# Altium schematic sheet CAn tranceiver.SchDoc
size 431 x 279 mm; SheetNumber: 6; SheetTotal: 6
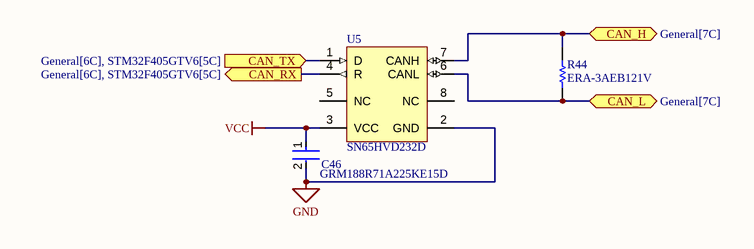
[diagram p0: CAn tranceiver.SchDoc]

## Parts
C46  GRM188R71A225KE15D  [FP-GRM188-0_1-e0_2_0_5-MFG]
R44  ERA-3AEB121V  [RESC1608X55X30NL20T20]
U5  SN65HVD232D  [D0008A_L]

## Ports
CAN_H (bidir, see General[7C]), CAN_L (bidir, see General[7C]), CAN_RX (out, see General[6C], STM32F405GTV6[5C]), CAN_TX (in, see General[6C], STM32F405GTV6[5C])

## Nets
GND: C46.2 U5.2(GND)
VCC: C46.1 U5.3(VCC)
CAN_H: R44.1 U5.7(CANH) ; port CAN_H
CAN_L: R44.2 U5.6(CANL) ; port CAN_L
CAN_RX: U5.4(R) ; port CAN_RX
CAN_TX: U5.1(D) ; port CAN_TX

Not connected (* = marked no-connect by the designer): U5 5(NC) 8(NC)

## Notes on the sheet
- DWG. NO.
- REV.
- SHT.
- THIS DOCUMENT AND THE DATA DISCLOSED HEREIN OR HEREWITH IS THE PROPERTY OF ALTIUM LIMITED AND MAY BE FREELY DISTRIBUTED IN WHOLE. NO RIGHTS ARE RESERVED OR EXPRESS OR IMPLIED WARANTEE GIVEN.
- REVISION
- DESCRIPTION
- DATE
- APPROVED
- ENG:
- APPROVALS
- PROJECT
- DSN:
- CHK:
- REFERENCE DOCUMENTS
- PROJECT REVISION:
- TITLE
- DOCUMENT REVISION:
- DESIGN ITEM:
- BOM:
- FAB DWG:
- PCB DWG:
- ASSY DWG:
- SCALE:
- SIZE
- B
- CAGE CODE
- FILE NAME
- DWG NO.
- SHEET
- OF
- REV

## Library data of the parts
C46 = CMP-2006-02836-2: Chip Multilayer Ceramic Capacitors for General Purpose, 0603, 2.2uF, X7R, 15%, 10%, 10V; Case Code (Metric): 1608; Height: 0.8mm; Packaging: Cut Tape; Voltage: 10V; Lead Free: Lead Free; Min Operating Temperature: -55°C; Voltage Rating (DC): 10V; Max Operating Temperature: 125°C; Voltage Rating: 10V; Dielectric: X7R; Depth: 0.8mm; Case Code (Imperial): 0603; Termination: SMD/SMT; Case/Package: 0603; Number of Pins: 2; REACH SVHC: No SVHC; Mount: Surface Mount; Width: 0.031inch; Material: Ceramic; Capacitance: 2.2uF; Package Quantity: 1; Weight: 7.1E-05oz; Length: 1.6mm; Thickness: 0.035inch; Tolerance: 10%
R44 = CMP-2000-00896-1: Manufacturer: Panasonic; Part Number: ERA-3AEB121V
U5 = CMP-0315-00073-2: 3.3 V CAN Transceiver, 17 mA, -40 to 85 degC, 8-pin SOIC (D), Green (RoHS & no Sb/Br); Manufacturer: Texas Instruments; Supply Voltage(s)(V): 3.3; Transient Pulse Protection(V): -25 to 25; ICC(Max)(mA): 17; Drivers Per Package: 1; Rating: Catalog; Code_JEDEC: MS-012AA; Mounting Technology: Surface Mount; PackageDescription: 8-Pin Plastic Small Outline Integrated Circuit, 4.9 x 3.9 mm, Pitch 1.27 mm Pitch; SubFamily: CAN; PackageVersion: revM, Jun-2011; Isolated: No; DatasheetVersion: SLOS346K; PackageReference: D0008A; Receivers Per Package: 1; Footprint: SN65HVD232; ComponentLink1Description: Datasheet; PartNumber: SN65HVD232D; Eco-Plan: Green (RoHS & no Sb/Br); ComponentLink1URL: http://www.ti.com/general/docs/lit/getliterature.tsp?genericPartNumber=SN65HVD232&fileType=pdf